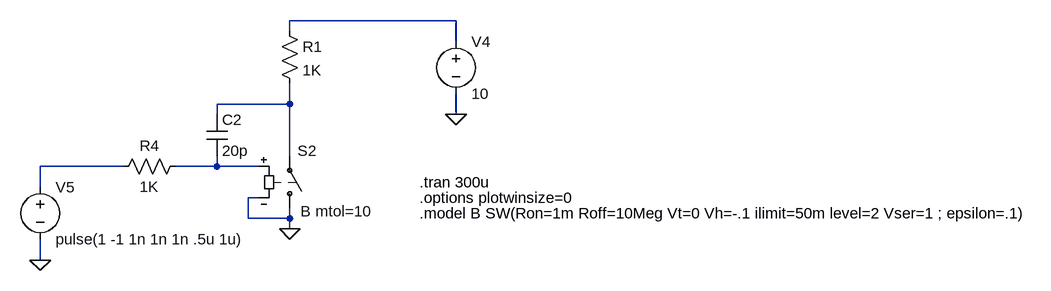
[diagram p0: schematic TSTS.asc]
TSTS.asc, the LTspice schematic file:
Version 4
SHEET 1 1636 680
WIRE 560 -448 304 -448
WIRE 304 -432 304 -448
WIRE 560 -416 560 -448
WIRE 304 -320 304 -352
WIRE 304 -320 192 -320
WIRE 192 -304 192 -320
WIRE 560 -304 560 -336
WIRE 304 -240 304 -320
WIRE 48 -224 -80 -224
WIRE 192 -224 192 -240
WIRE 192 -224 128 -224
WIRE 256 -224 192 -224
WIRE -80 -192 -80 -224
WIRE 256 -176 240 -176
WIRE 240 -144 240 -176
WIRE 304 -144 304 -160
WIRE 304 -144 240 -144
WIRE 304 -128 304 -144
WIRE -80 -80 -80 -112
FLAG -80 -80 0
FLAG 560 -304 0
FLAG 304 -128 0
SYMBOL res 288 -448 R0
SYMATTR InstName R1
SYMATTR Value 1K
SYMBOL voltage 560 -432 R0
SYMATTR Value 10
SYMATTR InstName V4
SYMBOL sw 304 -144 M180
WINDOW 0 12 104 Left 2
WINDOW 3 17 11 Left 2
SYMATTR InstName S2
SYMATTR Value B mtol=10
SYMBOL voltage -80 -208 R0
SYMATTR InstName V5
SYMATTR Value pulse(1 -1 1n 1n 1n .5u 1u)
SYMBOL res 144 -240 R90
WINDOW 0 0 56 VBottom 2
WINDOW 3 32 56 VTop 2
SYMATTR InstName R4
SYMATTR Value 1K
SYMBOL cap 176 -304 R0
SYMATTR InstName C2
SYMATTR Value 20p
TEXT 504 -152 Left 2 !.model B SW(Ron=1m Roff=10Meg Vt=0 Vh=-.1 ilimit=50m level=2 Vser=1 ; epsilon=.1)
TEXT 504 -200 Left 2 !.tran 300u
TEXT 504 -176 Left 2 !.options plotwinsize=0

The netlist it stands for:
* TSTS.asc
R1 N001 N002 1K
V4 N001 0 10
S2 0 N002 N004 0 B mtol=10
V5 N003 0 pulse(1 -1 1n 1n 1n .5u 1u)
R4 N004 N003 1K
C2 N002 N004 20p
.model B SW(Ron=1m Roff=10Meg Vt=0 Vh=-.1 ilimit=50m level=2 Vser=1 ; epsilon=.1)
.tran 300u
.options plotwinsize=0
.backanno
.end